# EAGLE design bt_rc_car_vehicle (EAGLE 9.5.1)
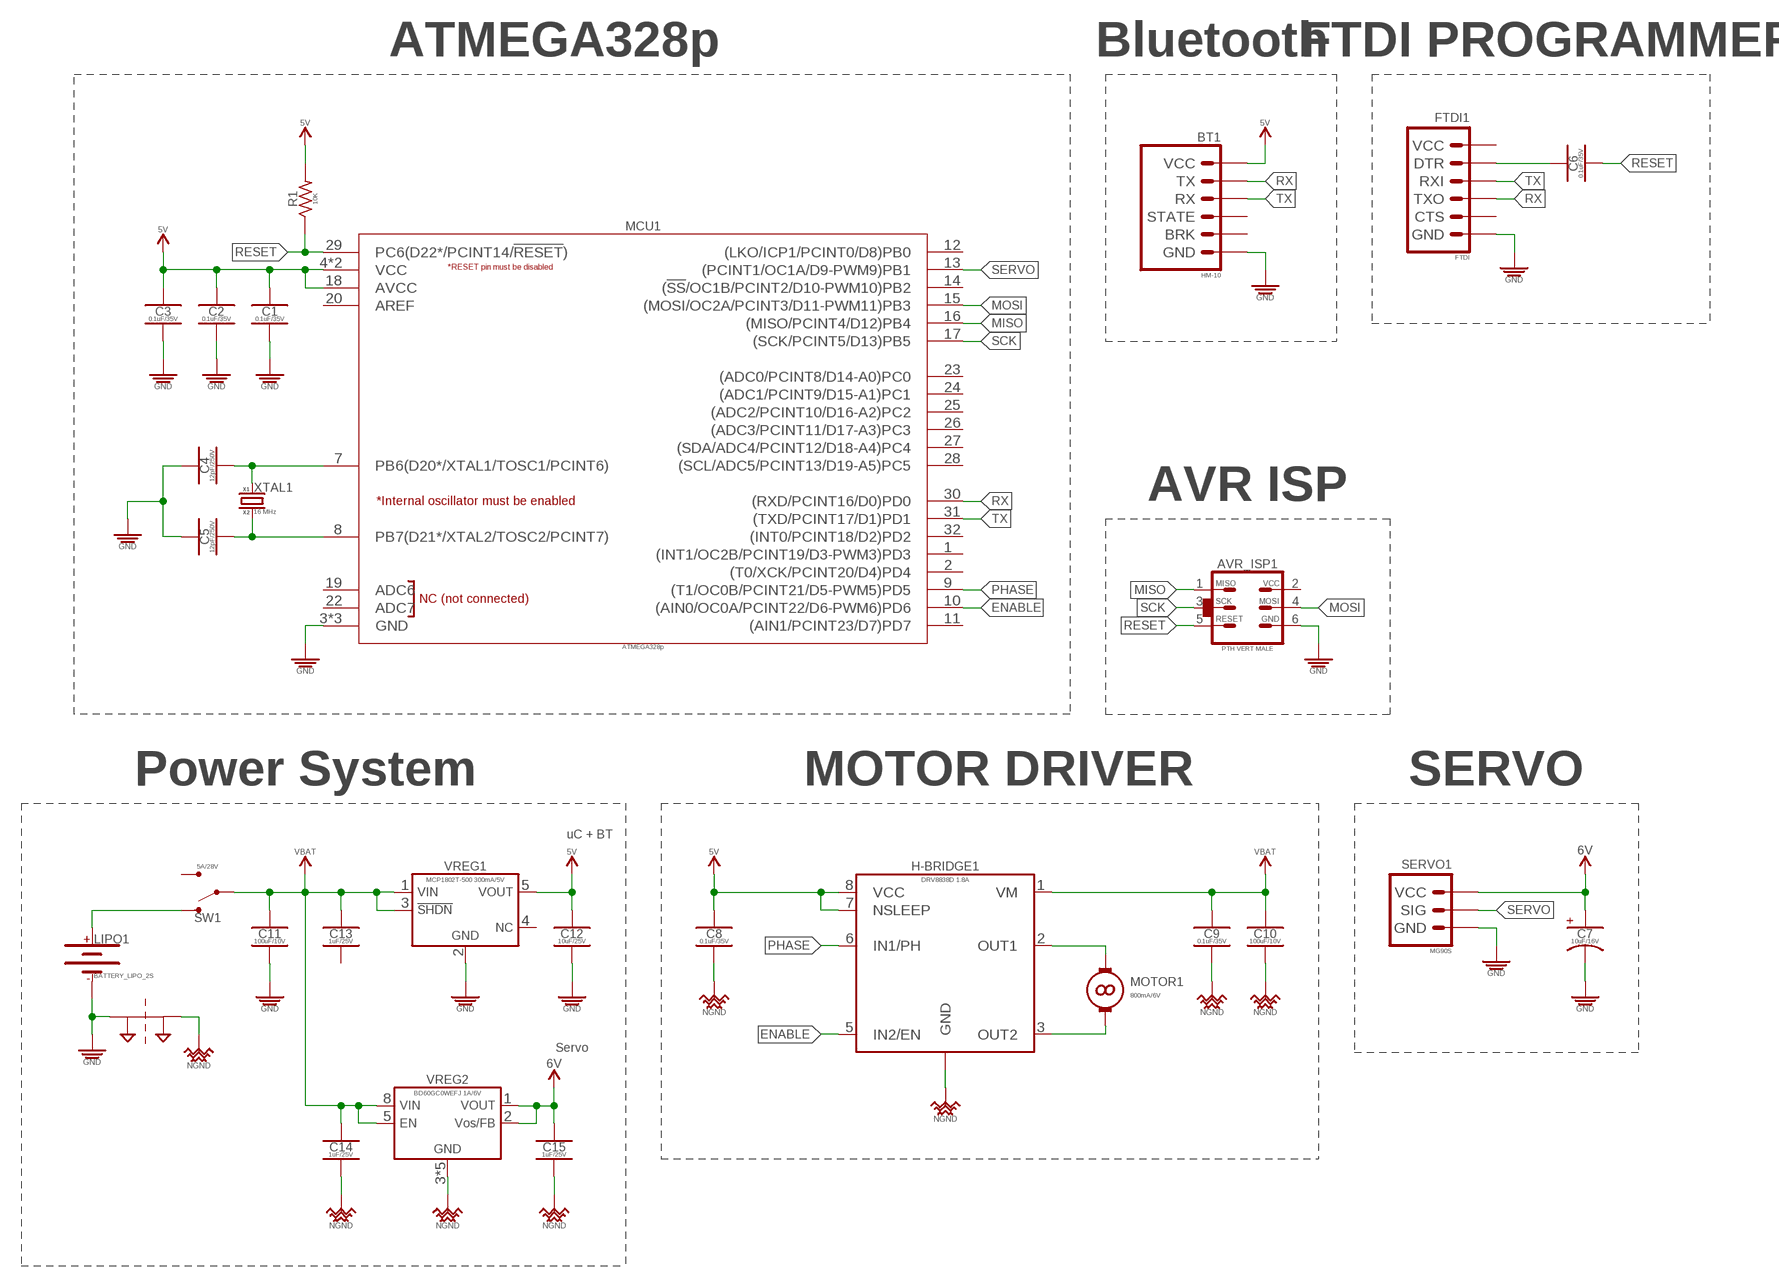
[diagram p0: schematic, sheet 1]

## Parts
AVR_ISP1  PTH VERT MALE  AVR_SPI_PRG_6_PTH_VERT_MALE_2.54MM  [HDRV6W64P254_2X3_762X483X838B_AVR-ISP]
BT1  HM-10  BLUETOOTH_HM-10_PTH_VERT_FEMALE_2.54MM  [HDRVR6W64P254_1X6_1574X254X850B]
C1  0.1uF/35V  0.1UF_SMD-0805_35V-10%  [CAPC2012X95_SMD-0805]
C2  0.1uF/35V  0.1UF_SMD-0805_35V-10%  [CAPC2012X95_SMD-0805]
C3  0.1uF/35V  0.1UF_SMD-0805_35V-10%  [CAPC2012X95_SMD-0805]
C4  12pF/250V  12PF_SMD-0805_250V-5%  [CAPC2012X95_SMD-0805]
C5  12pF/250V  12PF_SMD-0805_250V-5%  [CAPC2012X95_SMD-0805]
C6  0.1uF/35V  0.1UF_SMD-0805_35V-10%  [CAPC2012X95_SMD-0805]
C7  10uF/16V  10UF-POLARIZED_SMD-1206_16V-20%_  [CAPMP3216X180_SMD_CAP-TANT-1206]
C8  0.1uF/35V  0.1UF_SMD-0805_35V-10%  [CAPC2012X95_SMD-0805]
C9  0.1uF/35V  0.1UF_SMD-0805_35V-10%  [CAPC2012X95_SMD-0805]
C10  100uF/10V  100UF_CER_SMD-1210_16V-20%  [CAPC3225X270_SMD-1210]
C11  100uF/10V  100UF_CER_SMD-1210_16V-20%  [CAPC3225X270_SMD-1210]
C12  10uF/25V  10UF_CER_SMD-0805_25V-10%  [CAPC2012X95_SMD-0805]
C13  1uF/25V  1UF_CER_SMD-0805_25V-10%  [CAPC2012X95_SMD-0805]
C14  1uF/25V  1UF_CER_SMD-0805_25V-10%  [CAPC2012X95_SMD-0805]
C15  1uF/25V  1UF_CER_SMD-0805_25V-10%  [CAPC2012X95_SMD-0805]
FTDI1  FTDI  FTDI_PTH_VERT_MALE_2.54MM  [HDRV6W64P254_1X6_1524X254X838B_FTDI]
H-BRIDGE1  DRV8838D 1.8A  DRV883X_H-BRIDGE_DRV8838D_1.8A  [WSON-8-PPAD]
LIPO1  BATTERY_LIPO_2S  [DUAL_PTH_PADS]
MCU1  ATMEGA328p  ATMEGA328P-32_TQFP-32_ATMEGA328P  [QFP80P900X900X120-32]
MOTOR1  800mA/6V  MOTOR_SIZE-130  [CONNECTOR_MOTOR]
NET_BRIDGE1  NET_BRIDGE  [NET_BRIDGE]
R1  10K  10KΩ_SMD-0805_1/8W-5%  [RESC2012X60_SMD-0805]
SERVO1  MG90S  SERVO_MG90S_PTH_VERT_MALE_2.54MM  [HDRV3W64P254_1X3_762X254X838B]
SW1  5A/28V  SWITCH_SPDT_VERT_PTH_5A-28V_13L-7W_  [SW_TOGGLE_SPDT_5A-28V_13L-7W]
VREG1  MCP1802T-500 300mA/5V  MCP18XX_MCP1802-500_300MA-5V  [SOT95P280X145-5]
VREG2  BD60GC0WEFJ 1A/6V  BDXXGC0WEFJ_BD60GC0WEFJ_1A-6V  [SOIC127P600X100-8]
XTAL1  16 MHz  CRYSTAL_ABM3B_16MHZ_18PF  [OSCCC500X320X110_CRYSTAL]

## Nets
5V: BT1.VCC C1.1 C2.1 C3.1 C8.1 C12.1 H-BRIDGE1.7(NSLEEP) H-BRIDGE1.8(VCC) MCU1.4(VCC) MCU1.6(VCC) MCU1.18(AVCC) R1.2 VREG1.5(VOUT)
6V: C7.A C15.1 SERVO1.VCC VREG2.1(VOUT) VREG2.2(VOS/FB)
ENABLE: H-BRIDGE1.5(IN2/EN) MCU1.10((AIN0/OC0A/PCINT22/D6-PWM6)PD6)
GND: AVR_ISP1.GND BT1.GND C1.2 C2.2 C3.2 C4.1 C5.1 C7.K C11.2 C12.2 FTDI1.GND LIPO1.- MCU1.3(GND) MCU1.5(GND) MCU1.21(GND) NET_BRIDGE1.P$1 SERVO1.GND VREG1.2(GND)
MISO: AVR_ISP1.MISO MCU1.16((MISO/PCINT4/D12)PB4)
MOSI: AVR_ISP1.MOSI MCU1.15((MOSI/OC2A/PCINT3/D11-PWM11)PB3)
N$1: C5.2 MCU1.8(PB7(D21*/XTAL2/TOSC2/PCINT7)) XTAL1.3(XTAL2)
N$2: C4.2 MCU1.7(PB6(D20*/XTAL1/TOSC1/PCINT6)) XTAL1.1(XTAL1)
N$3: C6.1 FTDI1.DTR
N$4: H-BRIDGE1.2(OUT1) MOTOR1.+
N$5: H-BRIDGE1.3(OUT2) MOTOR1.-
N$6: LIPO1.+ SW1.S1
NGND: C8.2 C9.2 C10.2 C14.2 C15.2 H-BRIDGE1.4(GND) H-BRIDGE1.GND H-BRIDGE1.P$1(GND) H-BRIDGE1.P$2(GND) NET_BRIDGE1.P$2 VREG2.3(GND) VREG2.4(GND) VREG2.6(GND) VREG2.7(GND) VREG2.FIN(GND)
PHASE: H-BRIDGE1.6(IN1/PH) MCU1.9((T1/OC0B/PCINT21/D5-PWM5)PD5)
RESET: AVR_ISP1.RESET C6.2 MCU1.29(PC6(D22*/PCINT14/!RESET!)) R1.1
RX: BT1.TX FTDI1.TX(TXO) MCU1.30((RXD/PCINT16/D0)PD0)
SCK: AVR_ISP1.SCK MCU1.17((SCK/PCINT5/D13)PB5)
SERVO: MCU1.13((PCINT1/OC1A/D9-PWM9)PB1) SERVO1.SIG
TX: BT1.RX FTDI1.RX(RXI) MCU1.31((TXD/PCINT17/D1)PD1)
VBAT: C9.1 C10.1 C11.1 C13.1 C14.1 H-BRIDGE1.1(VM) SW1.P VREG1.1(VIN) VREG1.3(!SHDN) VREG2.5(EN) VREG2.8(VIN)
Unconnected: AVR_ISP1.VCC BT1.BRK BT1.STATE C13.2 FTDI1.CTS FTDI1.VCC MCU1.1((INT1/OC2B/PCINT19/D3-PWM3)PD3) MCU1.2((T0/XCK/PCINT20/D4)PD4) MCU1.11((AIN1/PCINT23/D7)PD7) MCU1.12((LKO/ICP1/PCINT0/D8)PB0) MCU1.14((!SS!/OC1B/PCINT2/D10-PWM10)PB2) MCU1.19(ADC6) MCU1.20(AREF) MCU1.22(ADC7) MCU1.23((ADC0/PCINT8/D14-A0)PC0) MCU1.24((ADC1/PCINT9/D15-A1)PC1) MCU1.25((ADC2/PCINT10/D16-A2)PC2) MCU1.26((ADC3/PCINT11/D17-A3)PC3) MCU1.27((SDA/ADC4/PCINT12/D18-A4)PC4) MCU1.28((SCL/ADC5/PCINT13/D19-A5)PC5) MCU1.32((INT0/PCINT18/D2)PD2) SW1.S2 VREG1.4(NC)

## Notes on the sheet
- ATMEGA328p | Bluetooth | FTDI PROGRAMMER
- AVR ISP
- Power System | MOTOR DRIVER | SERVO
- uC + BT
- Servo

## Library data of the parts
AVR_ISP1 = PiB_connectors:AVR_SPI_PRG_6: AVR ISP 6 Pin This is the reduced ISP connector for AVR programming. Common on Arduino. This footprint will take up less PCB space and can be used with a 10-pin to 6-pin adapter such as SKU: BOB-08508; DATASHEET: https://cdn.amphenol-icc.com/media/wysiwyg/files/drawing/67996.pdf; DIST: Digikey; DISTLINK: https://www.digikey.com/products/en?keywords=609-3234-ND; DISTPN: 609-3234-ND; MFR: Amphenol FCI; MPN: 67997-206HLF
BT1 = PiB_radio_frequency:BLUETOOTH_HM-10; DATASHEET: http://fab.cba.mit.edu/classes/863.15/doc/tutorials/programming/bluetooth/bluetooth40_en.pdf; DATASHEET_CONNECTOR: https://drawings-pdf.s3.amazonaws.com/10492.pdf; DIST: Amazon; DISTLINK: https://www.amazon.com/SunFounder-Bluetooth-Master-Module-Arduino/dp/B00V07U93U; DISTLINK_CONNECTOR: https://www.digikey.com/products/en?keywords=PPTC061LFBN-RC; DISTPN: BC24838; DISTPN_CONNECTOR: S7004-ND; DIST_CONNECTOR: Digikey; MFR: JNHuaMao Technology Company; MFR_CONNECTOR: Sullins Connector Solutions; MPN: HM-10; MPN_CONNECTOR: PPTC061LFBN-RC
C1-C3 C6 C8 C9 = PiB_capacitors:0.1UF; DATASHEET: http://ds.yuden.co.jp/TYCOMPAS/ut/detail.do?productNo=GMK212BJ104KGHT&fileName=GMK212BJ104KGHT_SS&mode=specSheetDownload; DIST: Digikey; DISTLINK: https://www.digikey.com/products/en?keywords=587-3364-1-ND; DISTPN: 587-3364-1-ND; MFR: Taiyo Yuden; MPN: GMK212BJ104KGHT
C4 C5 = PiB_capacitors:12PF; DATASHEET: http://search.murata.co.jp/Ceramy/image/img/A01X/G101/ENG/GRM21A5C2E120JW01-01.pdf; DIST: Digikey; DISTLINK: https://www.digikey.com/products/en?keywords=490-5531-1-ND; DISTPN: 490-5531-1-ND; MFR: Murata Electronics North America; MPN: GRM21A5C2E120JW01D
C7 = PiB_capacitors:10UF-POLARIZED; DATASHEET: http://datasheets.avx.com/TCJ.pdf; DIST: Digikey; DISTLINK: https://www.digikey.com/products/en?keywords=478-3451-1-ND; DISTPN: 478-3451-1-ND; MFR: TCJA106M016R0200; MPN: TCJA106M016R0200
C10 C11 = PiB_capacitors:100UF; DATASHEET: https://www.yuden.co.jp/productdata/catalog/mlcc01_hq_e.pdf; DIST: Digikey; DISTLINK: https://www.digikey.com/products/en?keywords=587-3432-1-ND; DISTPN: 587-3432-1-ND; MFR: Taiyo Yuden; MPN: LMK325ABJ107MMHT
C12 = PiB_capacitors:10UF; DATASHEET: http://search.murata.co.jp/Ceramy/image/img/A01X/G101/ENG/GRM21BR61E106MA73-01.pdf; DIST: Digikey; DISTLINK: https://www.digikey.com/products/en?keywords=490-10748-1-ND; DISTPN: 490-10748-1-ND; MFR: Murata Electronics North America; MPN: GRM21BR61E106MA73L
C13-C15 = PiB_capacitors:1UF; DATASHEET: https://api.kemet.com/component-edge/download/datasheet/C0805C105K3RACTU.pdf; DIST: Digikey; DISTLINK: https://www.digikey.com/products/en?keywords=399-8004-1-ND; DISTPN: 399-8004-1-ND; MFR: KEMET; MPN: C0805C105K3RACTU
FTDI1 = PiB_connectors:FTDI: FTDI Basic header with labels; DATASHEET: https://media.digikey.com/pdf/Data%20Sheets/Sparkfun%20PDFs/DEV-09873_Web.pdf; DATASHEET_CONNECTOR: https://drawings-pdf.s3.amazonaws.com/C10436.pdf; DIST: Digikey; DISTLINK: https://www.digikey.com/products/en?keywords=1568-1104-ND; DISTLINK_CONNECTOR: https://www.digikey.com/products/en?keywords=PEC06SAAN; DISTPN: 1568-1104-ND; DISTPN_CONNECTOR: S1012E-06-ND; DIST_CONNECTOR: Digikey; MFR: SparkFun Electronics; MFR_CONNECTOR: Sullins Connector Solutions; MPN: DEV-09873; MPN_CONNECTOR: PEC06SAAN
H-BRIDGE1 = PiB:DRV883X_H-BRIDGE: DRV883x Series H-Bridge - DRV8837 -> PWM (IN1 & IN2); DRV8838 -> PH IN1/ENA IN2; DATASHEET: http://www.ti.com/lit/ds/symlink/drv8838.pdf; DIST: Digikey; DISTLINK: https://www.digikey.com/products/en?keywords=296-40081-1-ND; DISTPN: 296-40081-1-ND; MFR: Texas Instruments; MPN: DRV8838DSGR
LIPO1 = PiB_batteries:BATTERY_LIPO_2S
MCU1 = PiB_ic_microcontrollers:ATMEGA328P-32: 32 pin ATMEGA328P IC; DATASHEET: http://ww1.microchip.com/downloads/en/DeviceDoc/Atmel-42735-8-bit-AVR-Microcontroller-ATmega328-328P_Datasheet.pdf; DATASHEET2: http://ww1.microchip.com/downloads/en/DeviceDoc/Atmel-42735-8-bit-AVR-Microcontroller-ATmega328-328P_Summary.pdf; DIST: Digikey; DISTLINK: https://www.digikey.com/products/en?keywords=ATMEGA328P-AU-ND; DISTPN: ATMEGA328P-AU-ND; MFR: Microchip Technology; MPN: ATMEGA328P-AU
MOTOR1 = PiB_motors:MOTOR; DATASHEET: https://www.pololu.com/product/1117/specs; DIST: Digikey; DISTLINK: https://www.pololu.com/product/1117; DISTPN: 1117; MFR: Pololu; MPN: 1117
NET_BRIDGE1 = PiB_power_symbols:NET_BRIDGE
R1 = PiB_resistors:10KΩ; DATASHEET: http://www.yageo.com/documents/recent/PYu-RC_Group_51_RoHS_L_9.pdf; DIST: Digikey; DISTLINK: https://www.digikey.com/products/en?keywords=311-10KARCT-ND; DISTPN: 311-10KARCT-ND; MFR: Yageo; MPN: RC0805JR-0710KL
SERVO1 = PiB_motors:SERVO; DATASHEET: N/A; DATASHEET_CONNECTOR: https://drawings-pdf.s3.amazonaws.com/C10436.pdf; DIST: Amazon; DISTLINK: https://www.amazon.com/RioRand-MG90S-Metal-Geared-Helicopter/dp/B00M8SR0ZK/ref=sr_1_1?s=toys-and-games&ie=UTF8&qid=1472114876&sr=1-1&keywords=MG90s+Micro+Metal+Geared+Servo; DISTLINK_CONNECTOR: https://www.digikey.com/products/en?keywords=S1012E-03-ND; DISTPN: B00M8SR0ZK; DISTPN_CONNECTOR: S1012E-03-ND; DIST_CONNECTOR: Digikey; MFR: TowerPro; MFR_CONNECTOR: Sullins Connector Solutions; MPN: MG90S; MPN_CONNECTOR: PEC03SAAN
SW1 = PiB_switches:SWITCH_SPDT; DATASHEET: http://spec_sheets.e-switch.com/specs/T111597.pdf; DIST: Digikey; DISTLINK: https://www.digikey.com/products/en?keywords=EG2355-ND; DISTPN: EG2355-ND; MFR: E-Switch; MPN: 100SP1T1B4M2QE
VREG1 = PiB_ic_power:MCP18XX; DATASHEET: http://ww1.microchip.com/downloads/en/DeviceDoc/22053C.pdf; DIST: Digikey; DISTLINK: https://www.digikey.com/products/en?keywords=MCP1802T-5002I%2FOTCT-ND; DISTPN: MCP1802T-5002I/OTCT-ND; MFR: Microchip Technology; MPN: MCP1802T-5002I/OT
VREG2 = PiB_ic_power:BDXXGC0WEFJ; DATASHEET: http://rohmfs.rohm.com/en/products/databook/datasheet/ic/power/linear_regulator/bdxxgc0wefj-e.pdf; DIST: Digikey; DISTLINK: https://www.digikey.com/products/en?keywords=BD60GC0WEFJ-E2CT-ND; DISTPN: BD60GC0WEFJ-E2CT-ND; MFR: Rohm Semiconductor; MPN: BD60GC0WEFJ-E2
XTAL1 = PiB_crystals_oscillators_resonators:CRYSTAL: Various standard crystals. Proven footprints.; DATASHEET: https://abracon.com/Resonators/abm3b.pdf; DIST: Digikey; DISTLINK: https://www.digikey.com/products/en?keywords=535-9122-1-ND; DISTPN: 535-9122-1-ND; MFR: Abracon LLC; MPN: ABM3B-16.000MHZ-B2-T

## Board
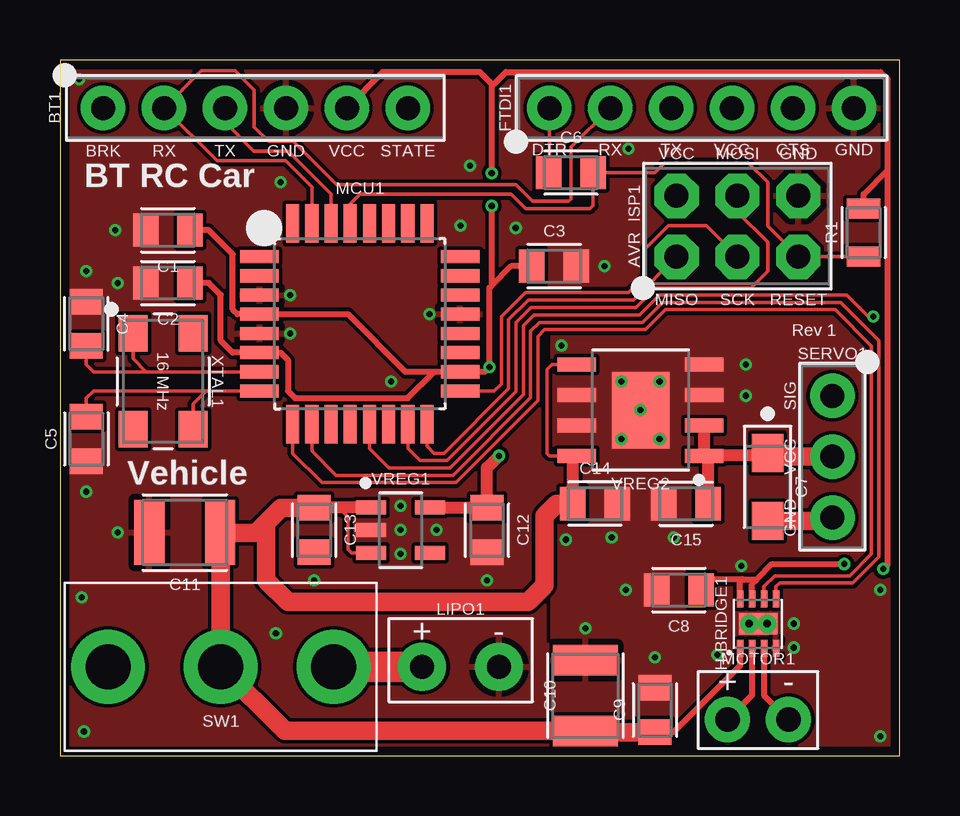
[diagram p1: board, top side]
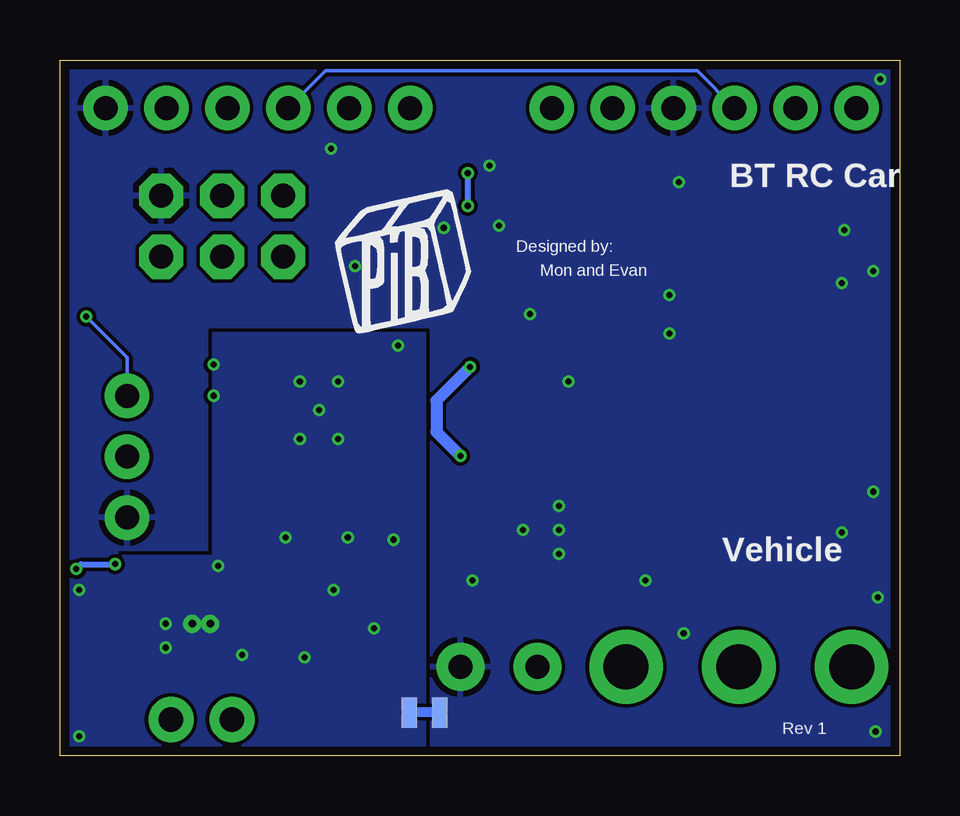
[diagram p2: board, bottom side, seen from below]

Size 35 x 29 mm. Coordinates in mm from the lower left corner, seen from the top.
Outline: 0,0 35,0 35,29 0,29 0,0
Copper layers (1*16): Top 0.035559375mm / dielectric 1.6mm / Bottom 0.035559375mm
Design rules "oshpark-2layer": minimum track width 6mil, minimum drill 10mil, track to track 6mil, track to pad 6mil, pad to pad 6mil, via to via 6mil, smd to smd 6mil, copper to edge 15mil, drill to drill 6mil, minimum pad ring 5mil, minimum via ring 5mil, stop-mask expansion 2.5mil, vias tented up to drill 0mil, thermal gap 10mil

### Footprints (pad centres in the part's own frame; a part is rotated, then mirrored left to right if it is on the bottom)
HDRV6W64P254_2X3_762X483X838B_AVR-ISP = drill 1 pad 1.85 octagon: GND 5.08,2.54; MISO 0,0; MOSI 2.54,2.54; RESET 5.08,0; SCK 2.54,0; VCC 0,2.54
HDRVR6W64P254_1X6_1574X254X850B = drill 1 pad 1.85: BRK 0,0; GND 7.62,0; RX 2.54,0; STATE 12.7,0; TX 5.08,0; VCC 10.16,0
CAPC2012X95_SMD-0805 = smd 1.065 x 1.379: 1 -0.925,0; 2 0.925,0
CAPMP3216X180_SMD_CAP-TANT-1206 = smd 1.586 x 1.329: A -1.414,0; K 1.414,0
CAPC3225X270_SMD-1210 = smd 1.26 x 2.715: 1 -1.475,0; 2 1.475,0
HDRV6W64P254_1X6_1524X254X838B_FTDI = drill 1 pad 1.85: CTS 10.16,0; DTR 0,0; GND 12.7,0; RX 2.54,0; TX 5.08,0; VCC 7.62,0
WSON-8-PPAD = smd 0.7 x 0.28: 1 -1.035,0.75; 2 -1.035,0.25; 3 -1.035,-0.25; 4 -1.035,-0.75; 5 1.035,-0.75; 6 1.035,-0.25; 7 1.035,0.25; 8 1.035,0.75 | smd 0.9 x 1.6: GND 0,0 | drill 0.33 pad 0.75: P$1 0,-0.38; P$2 0,0.37
DUAL_PTH_PADS = drill 1 pad 2: + -1.6,0; - 1.6,0
QFP80P900X900X120-32 = smd 1.6 x 0.547: 1 -4.181,2.8; 2 -4.181,2; 3 -4.181,1.2; 4 -4.181,0.4; 5 -4.181,-0.4; 6 -4.181,-1.2; 7 -4.181,-2; 8 -4.181,-2.8; 17 4.181,-2.8; 18 4.181,-2; 19 4.181,-1.2; 20 4.181,-0.4; 21 4.181,0.4; 22 4.181,1.2; 23 4.181,2; 24 4.181,2.8 | smd 0.547 x 1.6: 9 -2.8,-4.181; 10 -2,-4.181; 11 -1.2,-4.181; 12 -0.4,-4.181; 13 0.4,-4.181; 14 1.2,-4.181; 15 2,-4.181; 16 2.8,-4.181; 25 2.8,4.181; 26 2,4.181; 27 1.2,4.181; 28 0.4,4.181; 29 -0.4,4.181; 30 -1.2,4.181; 31 -2,4.181; 32 -2.8,4.181
CONNECTOR_MOTOR = drill 1.016 pad 1.88: + -1.27,0; - 1.27,0
NET_BRIDGE = smd 0.635 x 1.27: P$1 -0.635,0; P$2 0.635,0
RESC2012X60_SMD-0805 = smd 0.838 x 1.379: 1 -0.995,0; 2 0.995,0
HDRV3W64P254_1X3_762X254X838B = drill 1 pad 1.85: GND 5.08,0; SIG 0,0; VCC 2.54,0
SW_TOGGLE_SPDT_5A-28V_13L-7W = drill 1.875 pad 3.075: P 0,0; S1 0,-4.7; S2 0,4.7
SOT95P280X145-5 = smd 1.253 x 0.589: 1 -1.231,0.95; 2 -1.231,0; 3 -1.231,-0.95; 4 1.231,-0.95; 5 1.231,0.95
SOIC127P600X100-8 = smd 1.609 x 0.584: 1 -2.653,1.905; 2 -2.653,0.635; 3 -2.653,-0.635; 4 -2.653,-1.905; 5 2.653,-1.905; 6 2.653,-0.635; 7 2.653,0.635; 8 2.653,1.905 | smd 2.4 x 3.2: FIN 0,0
OSCCC500X320X110_CRYSTAL = smd 1.512 x 1.212: 1 -2,-1.25; 2 2,-1.25; 3 2,1.25; 4 -2,1.25

### Placement (x,y rotation side)
AVR_ISP1  25.7,20.8 0 top
BT1  1.8,27 0 top
C1  4.5,21.9 180 top
C2  4.5,19.7 180 top
C3  20.6,20.4 0 top
C4  1.1,18 270 top
C5  1.1,13.2 90 top
C6  21.3,24.3 0 top
C7  29.5,11.2 270 top
C8  25.8,6.9 180 top
C9  24.8,1.9 90 top
C10  21.9,2.5 90 top
C11  5.2,9.3 180 top
C12  17.8,9.4 270 top
C13  10.6,9.4 270 top
C14  22.3,10.5 0 top
C15  26.1,10.5 180 top
FTDI1  20.4,27 0 top
H-BRIDGE1  29.1,5.5 90 top
LIPO1  16.7,3.7 0 top
MCU1  12.5,18 0 top
MOTOR1  29.1,1.5 0 top
NET_BRIDGE1  19.8,1.8 180 bottom
R1  33.5,21.8 90 top
SERVO1  32.2,15 270 top
SW1  6.7,3.7 90 top
U$1  [PIB_LOGO_10MM]  20.7,20.6 0 bottom
VREG1  14.2,9.4 0 top
VREG2  24.2,14.4 180 top
XTAL1  4.3,15.6 270 top

### Tracks (layer width: path | path; a pad name or v marks a point on that pad's centre or on a via)
5V  (via drill 0.25)
  Top 0.254: C1.1 6.2,21.9 7.2,20.9 7.2,18.6 7.4,18.4 MCU1.4 12,18.4 14.4,16 15.6,16 | C2.1 6.2,19.7 6.7,19.2 6.7,17.3 7.2,16.8 MCU1.6 9.2,16.8 9.5,16.5 9.5,15.2 9.8,14.9 14.5,14.9 15.6,16 | v18,24.28 18,27.99 | 18,27.99 17.5,28.49 13.45,28.49 BT1.VCC | 18,27.99 18.09,27.99 18.59,28.49 34.2,28.49 34.49,28.2 34.49,24.4 | R1.2 33.5,23.41 34.49,24.4 | v34.32,7.78 34.49,7.95 34.49,24.4 | H-BRIDGE1.7 28.85,7.15 29.05,7.35 | v32.7,7.98 29.68,7.98 29.05,7.35 | 18,19.6 v18,22.92 | C3.1 18.8,20.4 18,19.6 | 18,19.6 17.9,19.5 v17.9,16.2 17.7,16 MCU1.18 15.6,16 | H-BRIDGE1.8 28.35,7.25 28.45,7.35 | 28.45,7.35 29.05,7.35 | 28.45,7.35 27.18,7.35 C8.1
  Top 0.508: VREG1.5 17.77,10.35 C12.1 17.8,11.99 v18.3,12.5
  Bottom 0.254: v18,22.92 v18,24.28 | v34.32,7.78 34.12,7.98 v32.7,7.98
  Bottom 0.508: v18.3,12.5 19.3,13.5 19.3,14.8 v17.9,16.2
6V
  Top 0.508: VREG2.1 26.87,12.51 29.4,12.51 C7.A | C15.1 27.02,12.32 VREG2.1 | VREG2.2 VREG2.1
  Top 0.762: SERVO1.VCC 29.65,12.46 C7.A
ENABLE
  Top 0.152: MCU1.10 10.5,12.7 11.51,11.69 16.38,11.69 19.62,14.93 19.62,17.7 19.98,18.06 24.29,18.06 25.12,18.89 32.55,18.89 34.14,17.3 34.14,8.27 33.06,7.2 30,7.2 29.85,7.04 H-BRIDGE1.5
GND  (via drill 0.25)
  Top 0.762: C7.K 32.07,9.79 SERVO1.GND
  other vias: 9.6,17.6 9.6,19.2 15.4,18.4 1.1,20.2 2.4,19.7 2.3,21.9 22.7,20.4 14.2,9.4 15.7,9.4 14.2,10.4 14.2,8.4 10.6,7.3 17.8,7.3 2.4,9.3 1.1,11 13.8,15.6 9.2,23.9 0.8,28.2 17.1,24.6 16.7,22.1 19,22 23.7,25.3 1,1 0.9,6.6 9,5.1
  pour Top (rank 6): 0,29 0,0 35,0 35,29
  pour Bottom (rank 6): 0,29 0,0 35,0 35,29
MISO
  Top 0.152: MCU1.16 15.3,12.9 15.6,12.6 16,12.6 18.7,15.3 18.7,18.17 19.53,19 23.9,19 AVR_ISP1.MISO
MOSI
  Top 0.152: MCU1.15 14.5,12.8 15.01,12.29 16.13,12.29 19.01,15.18 19.01,18.05 19.63,18.67 24,18.67 24.83,19.5 28.8,19.5 29.5,20.2 29.5,21.4 28.24,22.66 AVR_ISP1.MOSI
N$1
  Top 0.152: MCU1.8 6.1,15.2 | 6.1,15.2 1.4,15.2 1.1,14.9 C5.2 | XTAL1.3 5.55,14.65 6.1,15.2
N$2
  Top 0.152: C4.2 1.1,16.3 1.4,16 3.6,16 | 3.6,16 MCU1.7 | XTAL1.1 3.05,16.55 3.6,16
N$3
  Top 0.152: FTDI1.DTR 20.4,24.32 C6.1
N$4
  Top 0.254: H-BRIDGE1.2 28.85,2.52 MOTOR1.+
N$5
  Top 0.254: H-BRIDGE1.3 29.35,2.52 MOTOR1.-
N$6
  Top 1.27: LIPO1.+ SW1.S1
NGND  (via drill 0.25)
  other vias: 24.8,4.1 21.9,5.3 23.6,6.9 30.6,4.5 30.6,5.5 23,9.1 25.6,9.1 24.2,14.4 23.4,15.6 25,15.6 25,13.2 23.4,13.2 28.6,15 28.6,16.3 34.2,0.8 34.2,6.9 27.4,4.2 21.1,9 28.4,7.9 20.9,17.1
  pour Top: 20.5,18.6 20.5,0 36,0 36,9.2 33.6,9.2 33.6,18.6
  pour Bottom: 19.8,17.6 19.8,0 36,0 36,8.3 28.6,8.3 28.6,17.6
PHASE
  Top 0.152: MCU1.9 9.7,12.6 10.92,11.38 16.5,11.38 19.92,14.8 19.92,17.48 20.2,17.75 24.42,17.75 25.25,18.59 32.31,18.59 33.83,17.07 33.83,8.4 32.93,7.5 29.8,7.5 29.35,7.05 H-BRIDGE1.6
RESET
  Top 0.152: R1.1 AVR_ISP1.RESET 29.5,22.08 29.5,23.9 28.7,24.7 25.2,24.7 24.8,24.3 C6.2 22.23,22.93 22.1,22.8 19.4,22.8 18.8,23.4 12.5,23.4 12.1,23 MCU1.29
RX
  Top 0.152: BT1.TX 6.88,26.4 8.08,25.2 9.5,25.2 11.3,23.4 MCU1.30
  Bottom 0.152: BT1.TX 8.42,28.54 23.94,28.54 FTDI1.TX
SCK
  Top 0.152: MCU1.17 18.1,15.2 18.4,15.5 18.4,18.3 19.41,19.3 23.7,19.3 24.4,20 24.4,21.13 25.37,22.1 26.94,22.1 AVR_ISP1.SCK
SERVO  (via drill 0.25)
  Top 0.152: MCU1.13 12.9,12.8 13.71,11.99 16.25,11.99 19.31,15.05 19.31,17.92 19.76,18.36 24.16,18.36 25,19.2 32.8,19.2 33.7,18.3 v33.9,18.3
  Bottom 0.152: SERVO1.SIG 32.2,16.6 v33.9,18.3
TX
  Top 0.152: MCU1.31 10.5,23.7 9.4,24.8 6.54,24.8 BT1.RX 5.88,28.54 7.3,28.54 8.1,27.74 8.1,26.2 8.7,25.61 9.73,25.61 11.53,23.8 19,23.8 19.7,23.11 21.2,23.11 21.3,23.2 21.3,25.36 FTDI1.RX
VBAT
  Top 0.152: VREG2.5 20.5,16.3 20.3,16.1 20.3,12.6 20.41,12.49 VREG2.8 | VREG1.3 12.15,8.45 12,8.6 12,9.95 11.6,10.35
  Top 0.254: H-BRIDGE1.1 28.35,3.75 25.57,0.97 C9.1
  Top 0.508: C14.1 21.38,12.32 VREG2.8 | VREG1.1 11.6,10.35 10.62,10.35 C13.1
  Top 0.762: 6.7,9.28 SW1.P 9.38,1.02 C10.1 21.95,0.97 C9.1 | 6.7,9.28 C11.1 | C13.1 9.22,10.32 8.6,9.7 | 8.6,9.7 8.6,7.3 9.5,6.4 19.5,6.4 20.2,7.1 20.2,10 20.7,10.5 C14.1 | 8.6,9.7 8.18,9.28 6.7,9.28

### Text on the board
tPlace: BT RC Car | Rev 1 | Vehicle
bPlace: BT RC Car | Designed by: | Mon and Evan | Vehicle | Rev 1